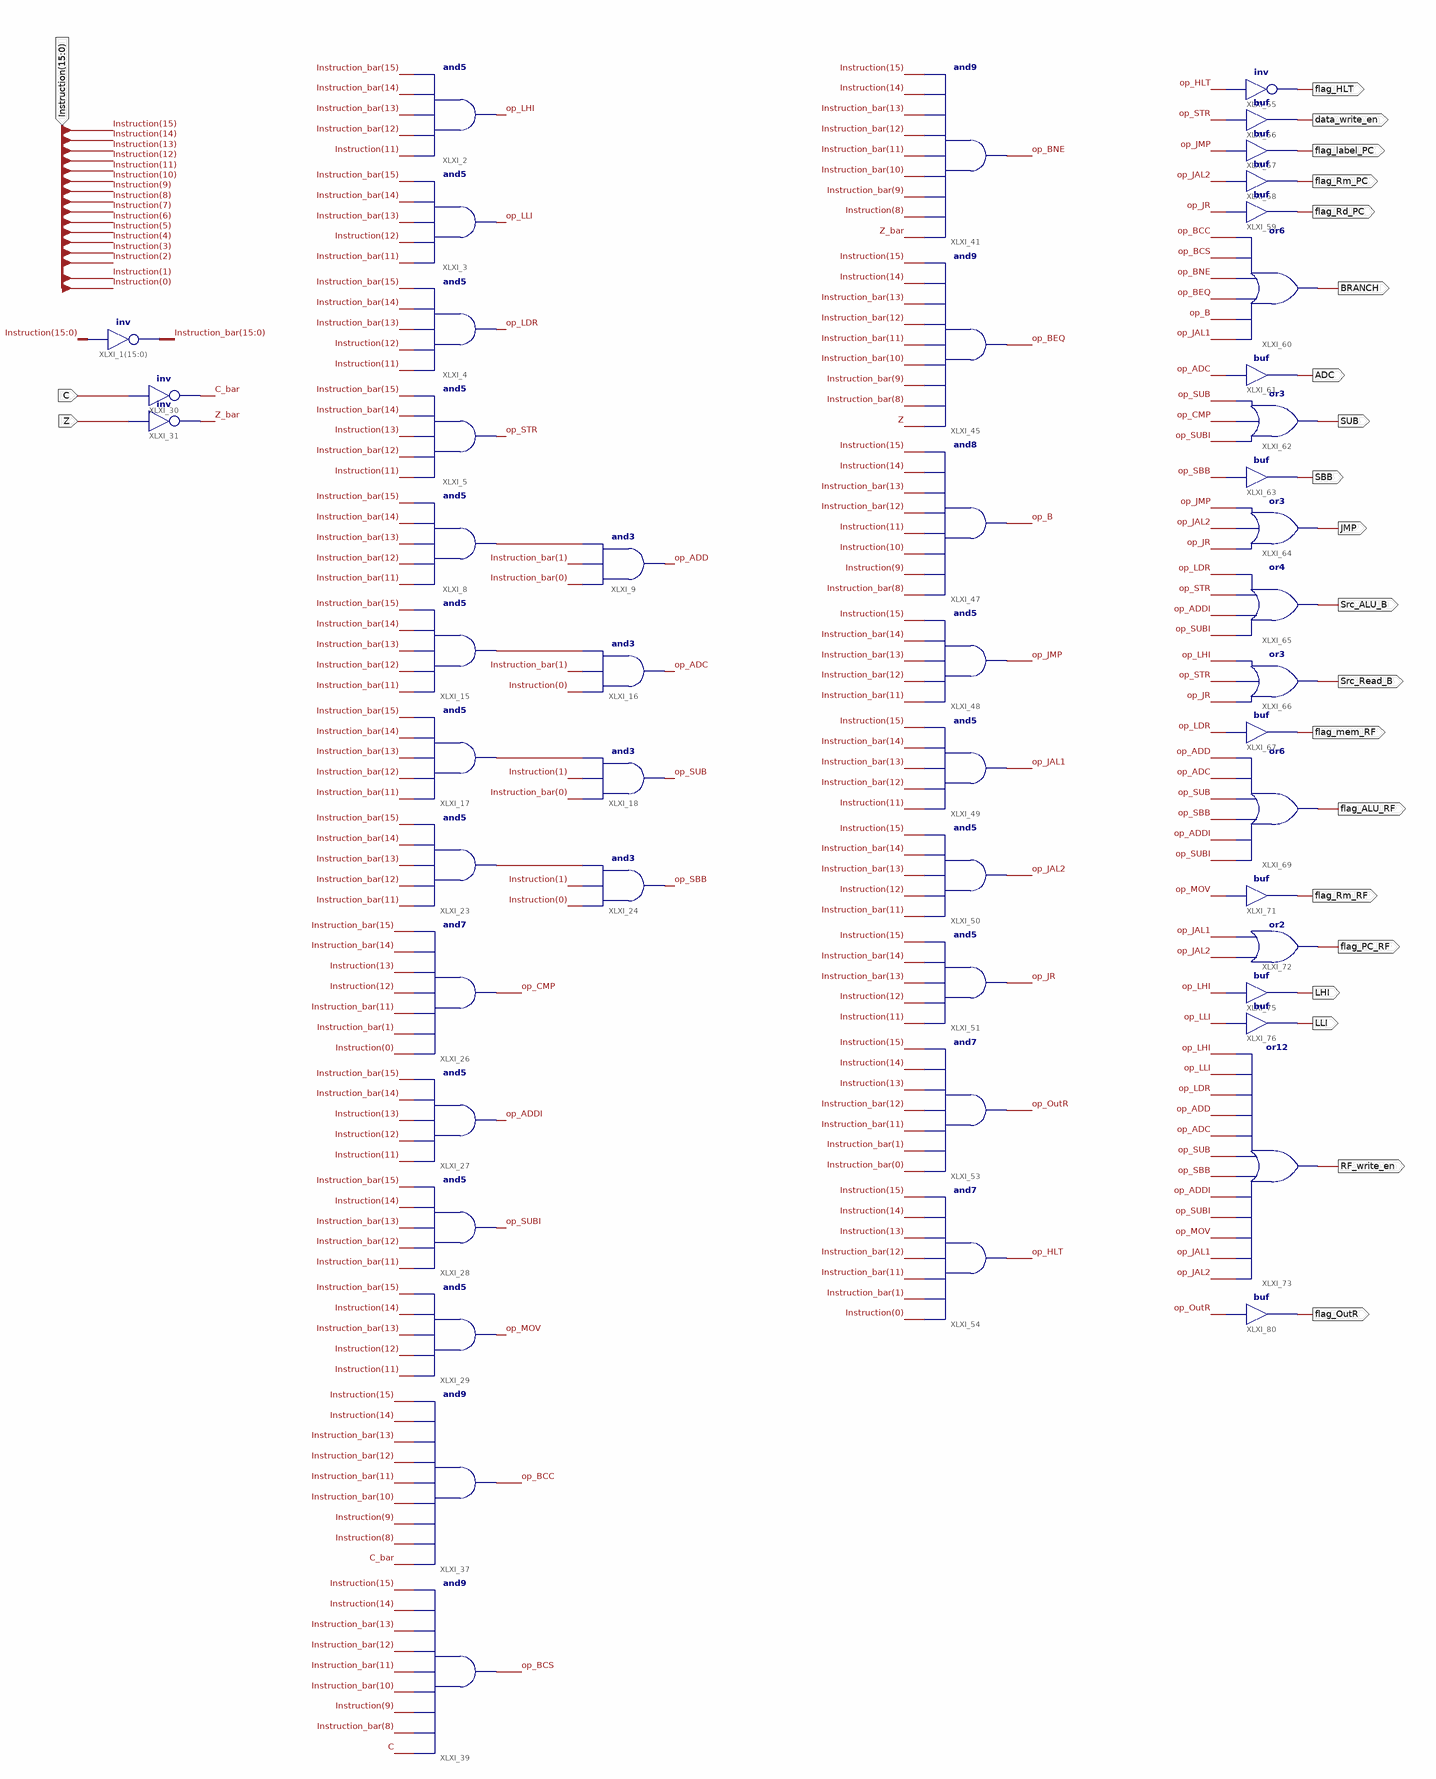
[diagram p0: schematic sheet 1]
// Xilinx ISE schematic Instruction_Decode.sch (virtex6) as structural Verilog: 50 symbols, 23 ports
module Instruction_Decode (
  input  [15:0] Instruction,
  input  C,
  input  Z,
  output flag_HLT,
  output data_write_en,
  output flag_label_PC,
  output flag_Rm_PC,
  output flag_Rd_PC,
  output BRANCH,
  output ADC,
  output SUB,
  output SBB,
  output JMP,
  output Src_ALU_B,
  output Src_Read_B,
  output flag_mem_RF,
  output flag_ALU_RF,
  output flag_Rm_RF,
  output flag_PC_RF,
  output LHI,
  output LLI,
  output RF_write_en,
  output flag_OutR
);

  wire C_bar, op_ADC, op_ADD, op_ADDI, op_B, op_BCC, op_BCS, op_BEQ, op_BNE, op_CMP, op_HLT, op_JAL1,
       op_JAL2, op_JMP, op_JR, op_LDR, op_LHI, op_LLI, op_MOV, op_OutR, op_SBB, op_STR, op_SUB, op_SUBI,
       XLXN_64, XLXN_77, XLXN_86, XLXN_113, Z_bar;
  wire [15:0] Instruction_bar;

  assign Instruction_bar = ~Instruction;  // inv XLXI_1[15..0], 16 bits wide
  and XLXI_2 (op_LHI, Instruction[11], Instruction_bar[12], Instruction_bar[13], Instruction_bar[14], Instruction_bar[15]);
  and XLXI_3 (op_LLI, Instruction_bar[11], Instruction[12], Instruction_bar[13], Instruction_bar[14], Instruction_bar[15]);
  and XLXI_4 (op_LDR, Instruction[11], Instruction[12], Instruction_bar[13], Instruction_bar[14], Instruction_bar[15]);
  and XLXI_5 (op_STR, Instruction[11], Instruction_bar[12], Instruction[13], Instruction_bar[14], Instruction_bar[15]);
  and XLXI_8 (XLXN_64, Instruction_bar[11], Instruction_bar[12], Instruction_bar[13], Instruction_bar[14], Instruction_bar[15]);
  and XLXI_9 (op_ADD, Instruction_bar[0], Instruction_bar[1], XLXN_64);
  and XLXI_15 (XLXN_77, Instruction_bar[11], Instruction_bar[12], Instruction_bar[13], Instruction_bar[14], Instruction_bar[15]);
  and XLXI_16 (op_ADC, Instruction[0], Instruction_bar[1], XLXN_77);
  and XLXI_17 (XLXN_86, Instruction_bar[11], Instruction_bar[12], Instruction_bar[13], Instruction_bar[14], Instruction_bar[15]);
  and XLXI_18 (op_SUB, Instruction_bar[0], Instruction[1], XLXN_86);
  and XLXI_23 (XLXN_113, Instruction_bar[11], Instruction_bar[12], Instruction_bar[13], Instruction_bar[14], Instruction_bar[15]);
  and XLXI_24 (op_SBB, Instruction[0], Instruction[1], XLXN_113);
  and XLXI_26 (op_CMP, Instruction[0], Instruction_bar[1], Instruction_bar[11], Instruction[12], Instruction[13], Instruction_bar[14], Instruction_bar[15]);
  and XLXI_27 (op_ADDI, Instruction[11], Instruction[12], Instruction[13], Instruction_bar[14], Instruction_bar[15]);
  and XLXI_28 (op_SUBI, Instruction_bar[11], Instruction_bar[12], Instruction_bar[13], Instruction[14], Instruction_bar[15]);
  and XLXI_29 (op_MOV, Instruction[11], Instruction[12], Instruction_bar[13], Instruction[14], Instruction_bar[15]);
  not XLXI_30 (C_bar, C);
  not XLXI_31 (Z_bar, Z);
  and XLXI_37 (op_BCC, C_bar, Instruction[8], Instruction[9], Instruction_bar[10], Instruction_bar[11], Instruction_bar[12], Instruction_bar[13], Instruction[14], Instruction[15]);
  and XLXI_39 (op_BCS, C, Instruction_bar[8], Instruction[9], Instruction_bar[10], Instruction_bar[11], Instruction_bar[12], Instruction_bar[13], Instruction[14], Instruction[15]);
  and XLXI_41 (op_BNE, Z_bar, Instruction[8], Instruction_bar[9], Instruction_bar[10], Instruction_bar[11], Instruction_bar[12], Instruction_bar[13], Instruction[14], Instruction[15]);
  and XLXI_45 (op_BEQ, Z, Instruction_bar[8], Instruction_bar[9], Instruction_bar[10], Instruction_bar[11], Instruction_bar[12], Instruction_bar[13], Instruction[14], Instruction[15]);
  and XLXI_47 (op_B, Instruction_bar[8], Instruction[9], Instruction[10], Instruction[11], Instruction_bar[12], Instruction_bar[13], Instruction[14], Instruction[15]);
  and XLXI_48 (op_JMP, Instruction_bar[11], Instruction_bar[12], Instruction_bar[13], Instruction_bar[14], Instruction[15]);
  and XLXI_49 (op_JAL1, Instruction[11], Instruction_bar[12], Instruction_bar[13], Instruction_bar[14], Instruction[15]);
  and XLXI_50 (op_JAL2, Instruction_bar[11], Instruction[12], Instruction_bar[13], Instruction_bar[14], Instruction[15]);
  and XLXI_51 (op_JR, Instruction[11], Instruction[12], Instruction_bar[13], Instruction_bar[14], Instruction[15]);
  and XLXI_53 (op_OutR, Instruction_bar[0], Instruction_bar[1], Instruction_bar[11], Instruction_bar[12], Instruction[13], Instruction[14], Instruction[15]);
  and XLXI_54 (op_HLT, Instruction[0], Instruction_bar[1], Instruction_bar[11], Instruction_bar[12], Instruction[13], Instruction[14], Instruction[15]);
  not XLXI_55 (flag_HLT, op_HLT);
  buf XLXI_56 (data_write_en, op_STR);
  buf XLXI_57 (flag_label_PC, op_JMP);
  buf XLXI_58 (flag_Rm_PC, op_JAL2);
  buf XLXI_59 (flag_Rd_PC, op_JR);
  or XLXI_60 (BRANCH, op_JAL1, op_B, op_BEQ, op_BNE, op_BCS, op_BCC);
  buf XLXI_61 (ADC, op_ADC);
  or XLXI_62 (SUB, op_SUBI, op_CMP, op_SUB);
  buf XLXI_63 (SBB, op_SBB);
  or XLXI_64 (JMP, op_JR, op_JAL2, op_JMP);
  or XLXI_65 (Src_ALU_B, op_SUBI, op_ADDI, op_STR, op_LDR);
  or XLXI_66 (Src_Read_B, op_JR, op_STR, op_LHI);
  buf XLXI_67 (flag_mem_RF, op_LDR);
  or XLXI_69 (flag_ALU_RF, op_SUBI, op_ADDI, op_SBB, op_SUB, op_ADC, op_ADD);
  buf XLXI_71 (flag_Rm_RF, op_MOV);
  or XLXI_72 (flag_PC_RF, op_JAL2, op_JAL1);
  buf XLXI_75 (LHI, op_LHI);
  buf XLXI_76 (LLI, op_LLI);
  or XLXI_73 (RF_write_en, op_JAL2, op_JAL1, op_MOV, op_SUBI, op_ADDI, op_SBB, op_SUB, op_ADC, op_ADD, op_LDR, op_LLI, op_LHI);
  buf XLXI_80 (flag_OutR, op_OutR);
endmodule
